# Altium schematic sheet LevelShifter.SchDoc
size A4
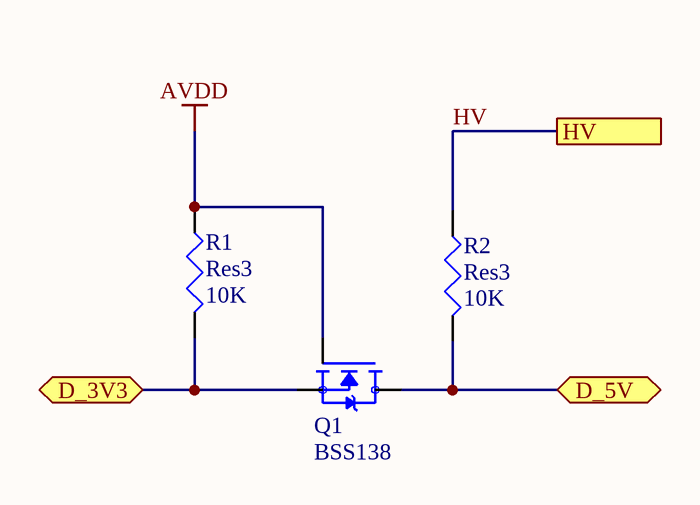
[diagram p0: LevelShifter.SchDoc]

## Parts
Q1  BSS138  [SOT95P240X111-3N]
R1  Res3  value 10K  [J1-0603]
R2  Res3  value 10K  [J1-0603]

## Ports
D_3V3 (bidir), D_5V (bidir), HV

## Nets
AVDD: Q1.1(G) R1.1
D_3V3: Q1.2(S) R1.2 ; port D_3V3
D_5V: Q1.3(D) R2.2 ; port D_5V
HV: R2.1 ; port HV

## Library data of the parts
Q1 = BSS138: N-Channel 50V 220mA (Ta) 360mW (Ta) Surface Mount SOT-23-3; MF: MICROSS/On Semiconductor; DigiKey-Purchase-URL: https://snapeda.com/shop?store=DigiKey&id=2773844; Package: TO-236-3 Micross; Arrow_Electronics-Purchase-URL: https://snapeda.com/shop?store=Arrow+Electronics&id=2773844; Value: *; MP: BSS138; Price: None; SnapEDA_Link: https://www.snapeda.com/parts/BSS138/MICROSS/On%20Semiconductor/view-part/2773844/?ref=snap; Mouser-Purchase-URL: https://snapeda.com/shop?store=Mouser&id=2773844; Availability: Good
R1 R2 = Res3: Resistor; Published: 8-Jun-2000; LatestRevisionDate: 29-May-2009; LatestRevisionNote: IPC-7351 Footprint Added.; PackageReference: J1-0603; Publisher: Altium Limited; PackageDescription: Chip Resistor